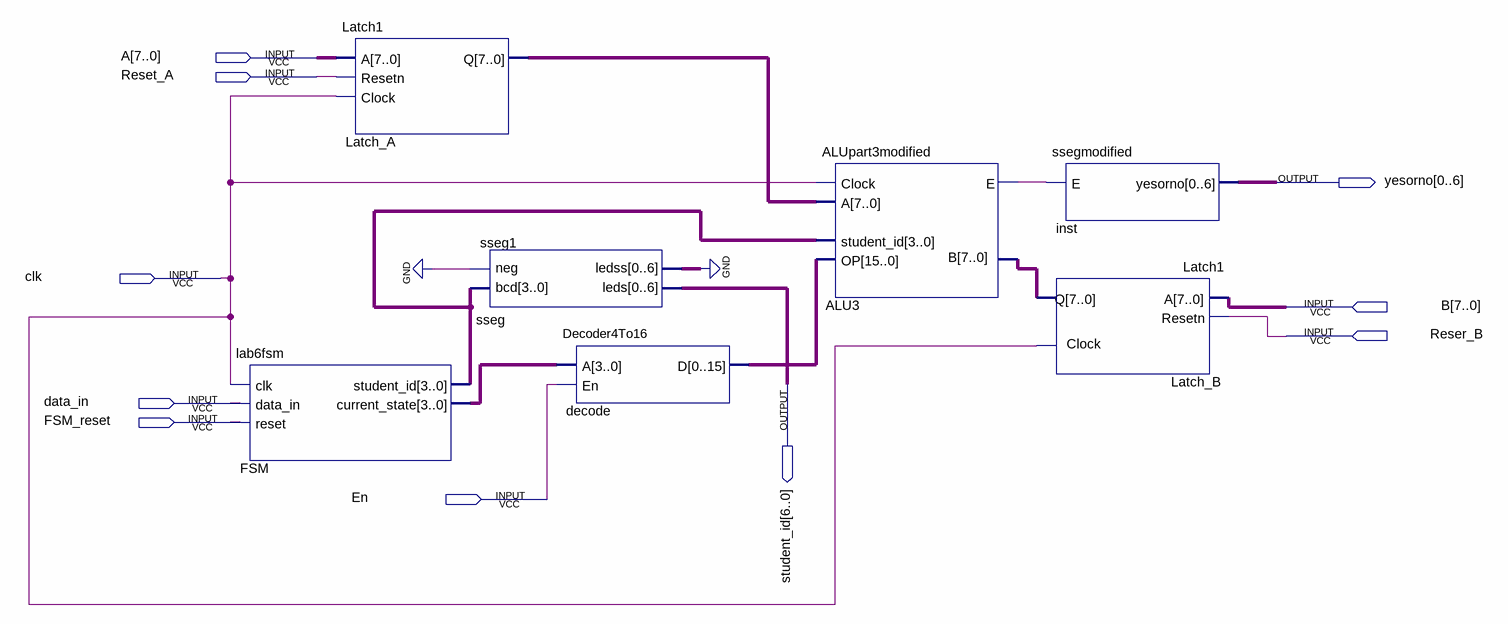
[diagram p0: schematic sheet]
// Quartus schematic ALUProblem3.bdf as structural Verilog: 7 symbols, 10 pins
module ALUProblem3 (
  input  [7:0] A,
  input  Reset_A,
  input  clk,
  input  [7:0] B,
  input  Reser_B,
  input  data_in,
  input  FSM_reset,
  input  En,
  output [0:6] yesorno,
  output [6:0] student_id
);

  wire ALU3_e;
  wire [3:0] FSM_current_state, FSM_student_id;
  wire [6:0] sseg1_ledss;
  wire [7:0] Latch_A_q, Latch_B_q;
  wire [15:0] decode_d;

  lab6fsm FSM (
    .clk(clk), .data_in(data_in), .reset(FSM_reset), .student_id(FSM_student_id),
    .current_state(FSM_current_state));
  Latch1 Latch_A (.A(A), .Resetn(Reset_A), .Clock(clk), .Q(Latch_A_q));
  sseg sseg1 (.bcd(FSM_student_id), .neg(1'b0), .leds(student_id), .ledss(sseg1_ledss));
  Decoder4To16 decode (.A(FSM_current_state), .En(En), .D(decode_d));
  ALUpart3modified ALU3 (
    .Clock(clk), .A(Latch_A_q), .B(Latch_B_q), .student_id(FSM_student_id), .OP(decode_d), .E(ALU3_e));
  ssegmodified inst (.E(ALU3_e), .yesorno(yesorno));
  Latch1 Latch_B (.A(B), .Resetn(Reser_B), .Clock(clk), .Q(Latch_B_q));
  // also tied to GND on the sheet: {sseg1_ledss[0], sseg1_ledss[1], sseg1_ledss[2], sseg1_ledss[3], sseg1_ledss[4], sseg1_ledss[5], sseg1_ledss[6]}
endmodule
